# EAGLE design LED Pannel (EAGLE 9.6.2)
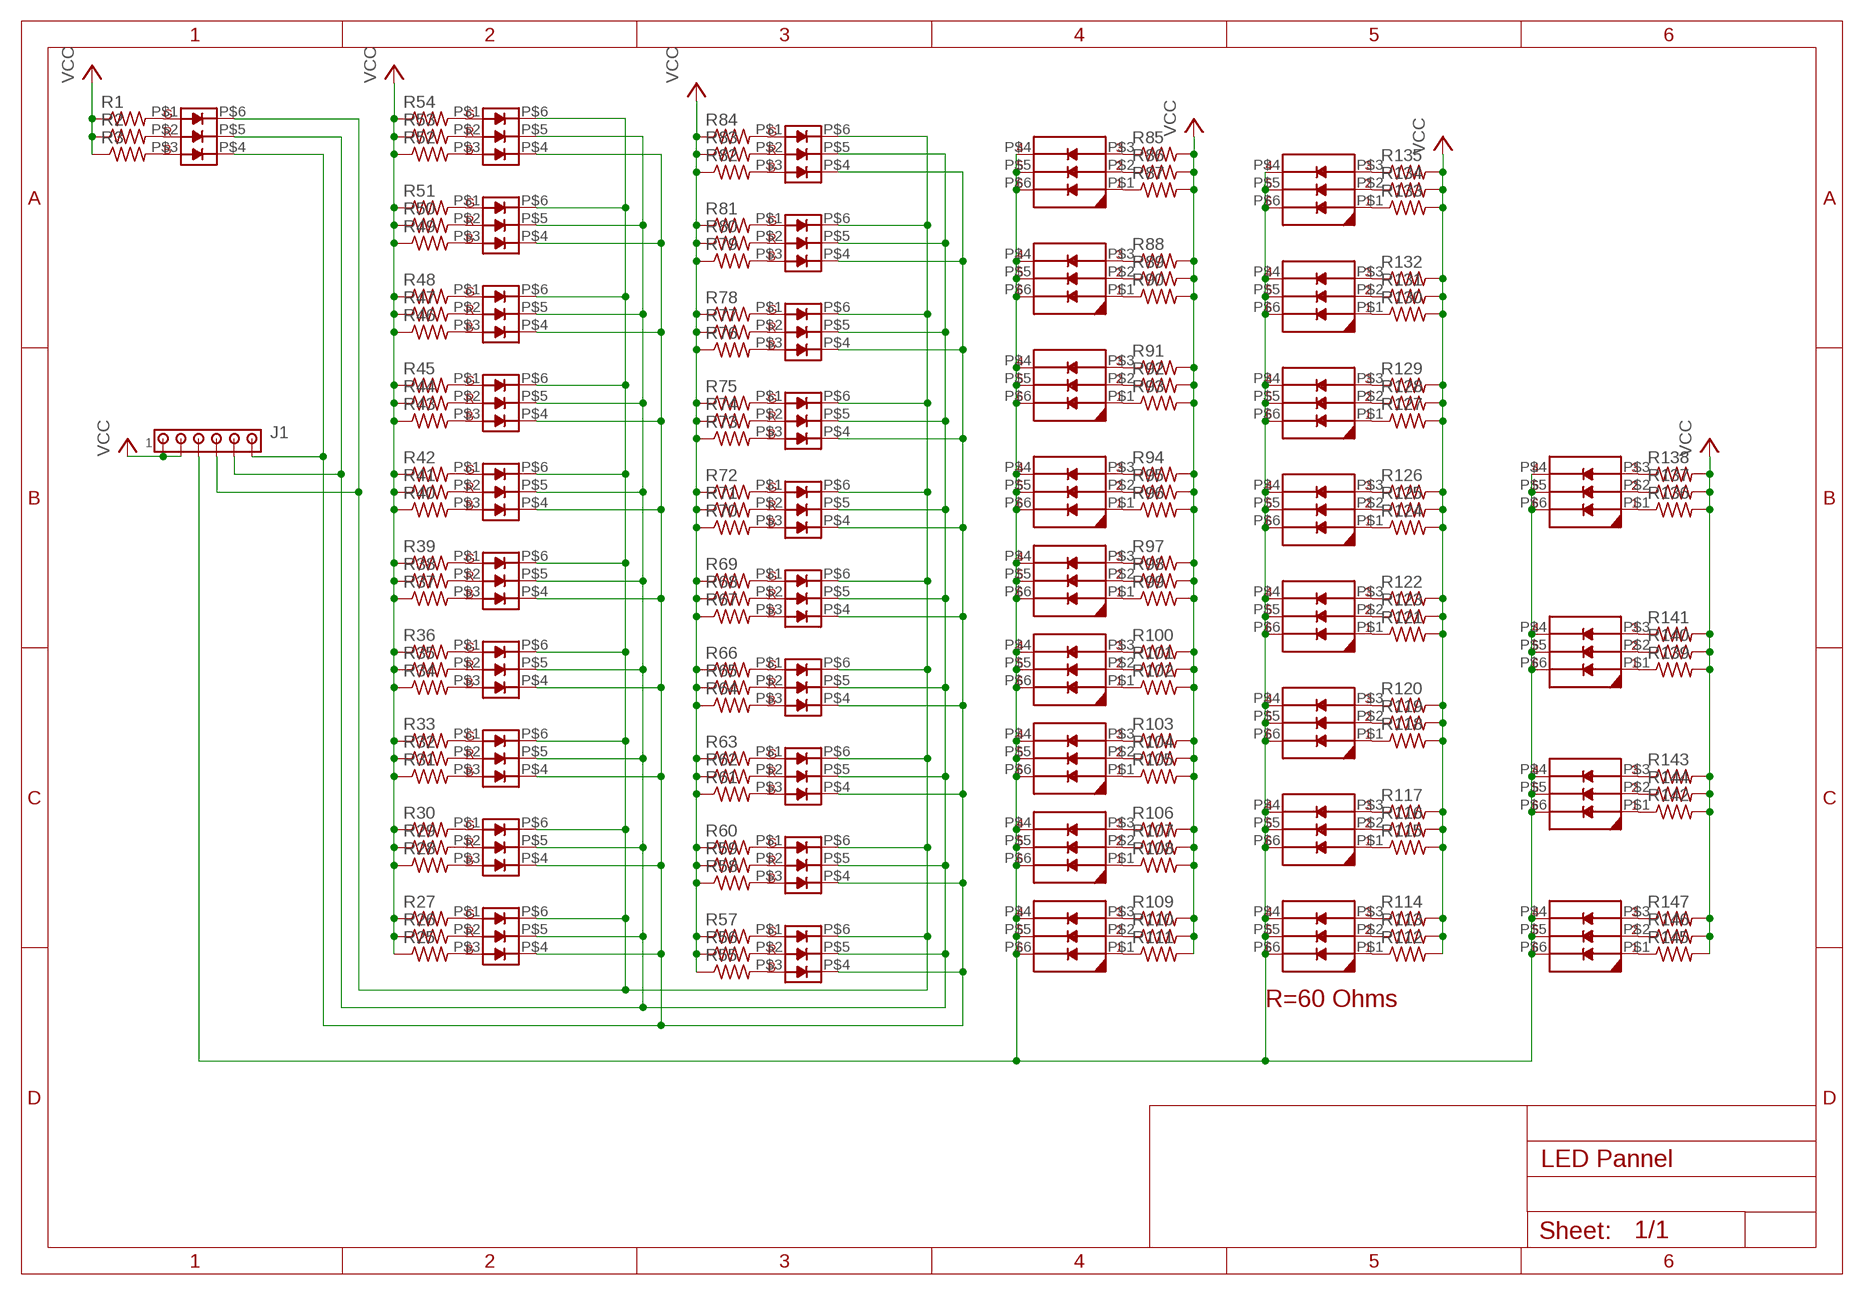
[diagram p0: schematic, sheet 1]

## Parts
J1  MTA06-156  [1X6MTA]
R1  R-US_R0603  [R0603]
R2  R-US_R0603  [R0603]
R3  R-US_R0603  [R0603]
R25  R-US_R0603  [R0603]
R26  R-US_R0603  [R0603]
R27  R-US_R0603  [R0603]
R28  R-US_R0603  [R0603]
R29  R-US_R0603  [R0603]
R30  R-US_R0603  [R0603]
R31  R-US_R0603  [R0603]
R32  R-US_R0603  [R0603]
R33  R-US_R0603  [R0603]
R34  R-US_R0603  [R0603]
R35  R-US_R0603  [R0603]
R36  R-US_R0603  [R0603]
R37  R-US_R0603  [R0603]
R38  R-US_R0603  [R0603]
R39  R-US_R0603  [R0603]
R40  R-US_R0603  [R0603]
R41  R-US_R0603  [R0603]
R42  R-US_R0603  [R0603]
R43  R-US_R0603  [R0603]
R44  R-US_R0603  [R0603]
R45  R-US_R0603  [R0603]
R46  R-US_R0603  [R0603]
R47  R-US_R0603  [R0603]
R48  R-US_R0603  [R0603]
R49  R-US_R0603  [R0603]
R50  R-US_R0603  [R0603]
R51  R-US_R0603  [R0603]
R52  R-US_R0603  [R0603]
R53  R-US_R0603  [R0603]
R54  R-US_R0603  [R0603]
R55  R-US_R0603  [R0603]
R56  R-US_R0603  [R0603]
R57  R-US_R0603  [R0603]
R58  R-US_R0603  [R0603]
R59  R-US_R0603  [R0603]
R60  R-US_R0603  [R0603]
R61  R-US_R0603  [R0603]
R62  R-US_R0603  [R0603]
R63  R-US_R0603  [R0603]
R64  R-US_R0603  [R0603]
R65  R-US_R0603  [R0603]
R66  R-US_R0603  [R0603]
R67  R-US_R0603  [R0603]
R68  R-US_R0603  [R0603]
R69  R-US_R0603  [R0603]
R70  R-US_R0603  [R0603]
R71  R-US_R0603  [R0603]
R72  R-US_R0603  [R0603]
R73  R-US_R0603  [R0603]
R74  R-US_R0603  [R0603]
R75  R-US_R0603  [R0603]
R76  R-US_R0603  [R0603]
R77  R-US_R0603  [R0603]
R78  R-US_R0603  [R0603]
R79  R-US_R0603  [R0603]
R80  R-US_R0603  [R0603]
R81  R-US_R0603  [R0603]
R82  R-US_R0603  [R0603]
R83  R-US_R0603  [R0603]
R84  R-US_R0603  [R0603]
R85  R-US_R0603  [R0603]
R86  R-US_R0603  [R0603]
R87  R-US_R0603  [R0603]
R88  R-US_R0603  [R0603]
R89  R-US_R0603  [R0603]
R90  R-US_R0603  [R0603]
R91  R-US_R0603  [R0603]
R92  R-US_R0603  [R0603]
R93  R-US_R0603  [R0603]
R94  R-US_R0603  [R0603]
R95  R-US_R0603  [R0603]
R96  R-US_R0603  [R0603]
R97  R-US_R0603  [R0603]
R98  R-US_R0603  [R0603]
R99  R-US_R0603  [R0603]
R100  R-US_R0603  [R0603]
R101  R-US_R0603  [R0603]
R102  R-US_R0603  [R0603]
R103  R-US_R0603  [R0603]
R104  R-US_R0603  [R0603]
R105  R-US_R0603  [R0603]
R106  R-US_R0603  [R0603]
R107  R-US_R0603  [R0603]
R108  R-US_R0603  [R0603]
R109  R-US_R0603  [R0603]
R110  R-US_R0603  [R0603]
R111  R-US_R0603  [R0603]
R112  R-US_R0603  [R0603]
R113  R-US_R0603  [R0603]
R114  R-US_R0603  [R0603]
R115  R-US_R0603  [R0603]
R116  R-US_R0603  [R0603]
R117  R-US_R0603  [R0603]
R118  R-US_R0603  [R0603]
R119  R-US_R0603  [R0603]
R120  R-US_R0603  [R0603]
R121  R-US_R0603  [R0603]
R122  R-US_R0603  [R0603]
R123  R-US_R0603  [R0603]
R124  R-US_R0603  [R0603]
R125  R-US_R0603  [R0603]
R126  R-US_R0603  [R0603]
R127  R-US_R0603  [R0603]
R128  R-US_R0603  [R0603]
R129  R-US_R0603  [R0603]
R130  R-US_R0603  [R0603]
R131  R-US_R0603  [R0603]
R132  R-US_R0603  [R0603]
R133  R-US_R0603  [R0603]
R134  R-US_R0603  [R0603]
R135  R-US_R0603  [R0603]
R136  R-US_R0603  [R0603]
R137  R-US_R0603  [R0603]
R138  R-US_R0603  [R0603]
R139  R-US_R0603  [R0603]
R140  R-US_R0603  [R0603]
R141  R-US_R0603  [R0603]
R142  R-US_R0603  [R0603]
R143  R-US_R0603  [R0603]
R144  R-US_R0603  [R0603]
R145  R-US_R0603  [R0603]
R146  R-US_R0603  [R0603]
R147  R-US_R0603  [R0603]
U$1  RGB_LED  [5050]
U$2  RGB_LED  [5050]
U$3  RGB_LED  [5050]
U$4  RGB_LED  [5050]
U$5  RGB_LED  [5050]
U$6  RGB_LED  [5050]
U$7  RGB_LED  [5050]
U$8  RGB_LED  [5050]
U$9  RGB_LED  [5050]
U$10  RGB_LED  [5050]
U$11  WHITE_LED  [5050]
U$12  WHITE_LED  [5050]
U$13  WHITE_LED  [5050]
U$14  WHITE_LED  [5050]
U$15  WHITE_LED  [5050]
U$16  WHITE_LED  [5050]
U$17  RGB_LED  [5050]
U$18  RGB_LED  [5050]
U$19  RGB_LED  [5050]
U$20  RGB_LED  [5050]
U$21  RGB_LED  [5050]
U$22  RGB_LED  [5050]
U$23  RGB_LED  [5050]
U$24  RGB_LED  [5050]
U$25  RGB_LED  [5050]
U$26  RGB_LED  [5050]
U$27  RGB_LED  [5050]
U$35  WHITE_LED  [5050]
U$36  WHITE_LED  [5050]
U$37  WHITE_LED  [5050]
U$38  WHITE_LED  [5050]
U$47  WHITE_LED  [5050]
U$48  WHITE_LED  [5050]
U$49  WHITE_LED  [5050]
U$50  WHITE_LED  [5050]
U$51  WHITE_LED  [5050]
U$52  WHITE_LED  [5050]
U$53  WHITE_LED  [5050]
U$54  WHITE_LED  [5050]
U$55  WHITE_LED  [5050]
U$56  WHITE_LED  [5050]
U$57  WHITE_LED  [5050]

## Nets
N$1: R1.2 U$27.P$1
N$2: R2.2 U$27.P$2
N$3: R3.2 U$27.P$3
N$4: J1.4 U$1.P$6 U$2.P$6 U$3.P$6 U$4.P$6 U$5.P$6 U$6.P$6 U$7.P$6 U$8.P$6 U$9.P$6 U$10.P$6 U$17.P$6 U$18.P$6 U$19.P$6 U$20.P$6 U$21.P$6 U$22.P$6 U$23.P$6 U$24.P$6 U$25.P$6 U$26.P$6 U$27.P$6
N$5: J1.5 U$1.P$5 U$2.P$5 U$3.P$5 U$4.P$5 U$5.P$5 U$6.P$5 U$7.P$5 U$8.P$5 U$9.P$5 U$10.P$5 U$17.P$5 U$18.P$5 U$19.P$5 U$20.P$5 U$21.P$5 U$22.P$5 U$23.P$5 U$24.P$5 U$25.P$5 U$26.P$5 U$27.P$5
N$6: J1.6 U$1.P$4 U$2.P$4 U$3.P$4 U$4.P$4 U$5.P$4 U$6.P$4 U$7.P$4 U$8.P$4 U$9.P$4 U$10.P$4 U$17.P$4 U$18.P$4 U$19.P$4 U$20.P$4 U$21.P$4 U$22.P$4 U$23.P$4 U$24.P$4 U$25.P$4 U$26.P$4 U$27.P$4
N$9: J1.3 U$11.P$4 U$11.P$5 U$11.P$6 U$12.P$4 U$12.P$5 U$12.P$6 U$13.P$4 U$13.P$5 U$13.P$6 U$14.P$4 U$14.P$5 U$14.P$6 U$15.P$4 U$15.P$5 U$15.P$6 U$16.P$4 U$16.P$5 U$16.P$6 U$35.P$4 U$35.P$5 U$35.P$6 U$36.P$4 U$36.P$5 U$36.P$6 U$37.P$4 U$37.P$5 U$37.P$6 U$38.P$4 U$38.P$5 U$38.P$6 U$47.P$4 U$47.P$5 U$47.P$6 U$48.P$4 U$48.P$5 U$48.P$6 U$49.P$4 U$49.P$5 U$49.P$6 U$50.P$4 U$50.P$5 U$50.P$6 U$51.P$4 U$51.P$5 U$51.P$6 U$52.P$4 U$52.P$5 U$52.P$6 U$53.P$4 U$53.P$5 U$53.P$6 U$54.P$4 U$54.P$5 U$54.P$6 U$55.P$4 U$55.P$5 U$55.P$6 U$56.P$4 U$56.P$5 U$56.P$6 U$57.P$4 U$57.P$5 U$57.P$6
N$24: R25.2 U$26.P$3
N$25: R26.2 U$26.P$2
N$26: R28.2 U$25.P$3
N$27: R29.2 U$25.P$2
N$28: R30.2 U$25.P$1
N$30: R27.2 U$26.P$1
N$31: R31.2 U$24.P$3
N$32: R32.2 U$24.P$2
N$33: R33.2 U$24.P$1
N$34: R34.2 U$23.P$3
N$35: R35.2 U$23.P$2
N$36: R36.2 U$23.P$1
N$37: R37.2 U$22.P$3
N$38: R38.2 U$22.P$2
N$39: R39.2 U$22.P$1
N$40: R40.2 U$21.P$3
N$41: R41.2 U$21.P$2
N$42: R42.2 U$21.P$1
N$43: R43.2 U$20.P$3
N$44: R44.2 U$20.P$2
N$45: R45.2 U$20.P$1
N$46: R46.2 U$19.P$3
N$47: R47.2 U$19.P$2
N$48: R48.2 U$19.P$1
N$49: R49.2 U$18.P$3
N$50: R50.2 U$18.P$2
N$51: R51.2 U$18.P$1
N$52: R52.2 U$17.P$3
N$53: R53.2 U$17.P$2
N$54: R54.2 U$17.P$1
N$55: R56.2 U$1.P$2
N$56: R57.2 U$1.P$1
N$57: R55.2 U$1.P$3
N$58: R58.2 U$2.P$3
N$59: R59.2 U$2.P$2
N$60: R60.2 U$2.P$1
N$61: R61.2 U$3.P$3
N$62: R62.2 U$3.P$2
N$63: R63.2 U$3.P$1
N$64: R64.2 U$4.P$3
N$65: R65.2 U$4.P$2
N$66: R66.2 U$4.P$1
N$67: R68.2 U$5.P$2
N$68: R69.2 U$5.P$1
N$69: R67.2 U$5.P$3
N$70: R70.2 U$6.P$3
N$71: R71.2 U$6.P$2
N$72: R72.2 U$6.P$1
N$73: R73.2 U$7.P$3
N$74: R74.2 U$7.P$2
N$75: R75.2 U$7.P$1
N$76: R76.2 U$8.P$3
N$77: R77.2 U$8.P$2
N$78: R78.2 U$8.P$1
N$79: R79.2 U$9.P$3
N$80: R80.2 U$9.P$2
N$81: R81.2 U$9.P$1
N$82: R82.2 U$10.P$3
N$83: R83.2 U$10.P$2
N$84: R84.2 U$10.P$1
N$85: R85.1 U$49.P$3
N$86: R86.1 U$49.P$2
N$87: R87.1 U$49.P$1
N$88: R88.1 U$48.P$3
N$89: R89.1 U$48.P$2
N$90: R90.1 U$48.P$1
N$91: R91.1 U$47.P$3
N$92: R92.1 U$47.P$2
N$93: R93.1 U$47.P$1
N$94: R95.1 U$16.P$2
N$95: R96.1 U$16.P$1
N$96: R94.1 U$16.P$3
N$97: R97.1 U$15.P$3
N$98: R98.1 U$15.P$2
N$99: R99.1 U$15.P$1
N$100: R100.1 U$14.P$3
N$101: R101.1 U$14.P$2
N$102: R102.1 U$14.P$1
N$103: R103.1 U$13.P$3
N$104: R104.1 U$13.P$2
N$105: R105.1 U$13.P$1
N$106: R106.1 U$12.P$3
N$107: R107.1 U$12.P$2
N$108: R108.1 U$12.P$1
N$109: R109.1 U$11.P$3
N$110: R110.1 U$11.P$2
N$111: R111.1 U$11.P$1
N$112: R112.1 U$57.P$1
N$113: R113.1 U$57.P$2
N$114: R114.1 U$57.P$3
N$115: R115.1 U$56.P$1
N$116: R116.1 U$56.P$2
N$117: R117.1 U$56.P$3
N$118: R118.1 U$55.P$1
N$119: R119.1 U$55.P$2
N$120: R120.1 U$55.P$3
N$121: R121.1 U$54.P$1
N$122: R122.1 U$54.P$3
N$123: R123.1 U$54.P$2
N$124: R124.1 U$53.P$1
N$125: R125.1 U$53.P$2
N$126: R126.1 U$53.P$3
N$127: R127.1 U$52.P$1
N$128: R128.1 U$52.P$2
N$129: R129.1 U$52.P$3
N$130: R130.1 U$51.P$1
N$131: R131.1 U$51.P$2
N$132: R132.1 U$51.P$3
N$133: R133.1 U$50.P$1
N$134: R134.1 U$50.P$2
N$135: R135.1 U$50.P$3
N$136: R136.1 U$38.P$1
N$137: R137.1 U$38.P$2
N$138: R138.1 U$38.P$3
N$139: R139.1 U$37.P$1
N$140: R140.1 U$37.P$2
N$141: R141.1 U$37.P$3
N$142: R142.1 U$36.P$1
N$143: R143.1 U$36.P$3
N$144: R144.1 U$36.P$2
N$145: R145.1 U$35.P$1
N$146: R146.1 U$35.P$2
N$147: R147.1 U$35.P$3
VCC: J1.1 J1.2 R1.1 R2.1 R3.1 R25.1 R26.1 R27.1 R28.1 R29.1 R30.1 R31.1 R32.1 R33.1 R34.1 R35.1 R36.1 R37.1 R38.1 R39.1 R40.1 R41.1 R42.1 R43.1 R44.1 R45.1 R46.1 R47.1 R48.1 R49.1 R50.1 R51.1 R52.1 R53.1 R54.1 R55.1 R56.1 R57.1 R58.1 R59.1 R60.1 R61.1 R62.1 R63.1 R64.1 R65.1 R66.1 R67.1 R68.1 R69.1 R70.1 R71.1 R72.1 R73.1 R74.1 R75.1 R76.1 R77.1 R78.1 R79.1 R80.1 R81.1 R82.1 R83.1 R84.1 R85.2 R86.2 R87.2 R88.2 R89.2 R90.2 R91.2 R92.2 R93.2 R94.2 R95.2 R96.2 R97.2 R98.2 R99.2 R100.2 R101.2 R102.2 R103.2 R104.2 R105.2 R106.2 R107.2 R108.2 R109.2 R110.2 R111.2 R112.2 R113.2 R114.2 R115.2 R116.2 R117.2 R118.2 R119.2 R120.2 R121.2 R122.2 R123.2 R124.2 R125.2 R126.2 R127.2 R128.2 R129.2 R130.2 R131.2 R132.2 R133.2 R134.2 R135.2 R136.2 R137.2 R138.2 R139.2 R140.2 R141.2 R142.2 R143.2 R144.2 R145.2 R146.2 R147.2

## Notes on the sheet
- R=60 Ohms

## Library data of the parts
J1 = con-amp:MTA06-156: AMP connector
R1-R3 R25-R147 = rcl:R-US_: RESISTOR, American symbol; SPICEPREFIX: R
U$1-U$10 U$17-U$27 = RGB LED:RGB_LED
U$11-U$16 U$35-U$38 U$47-U$57 = white led:WHITE_LED

## Board
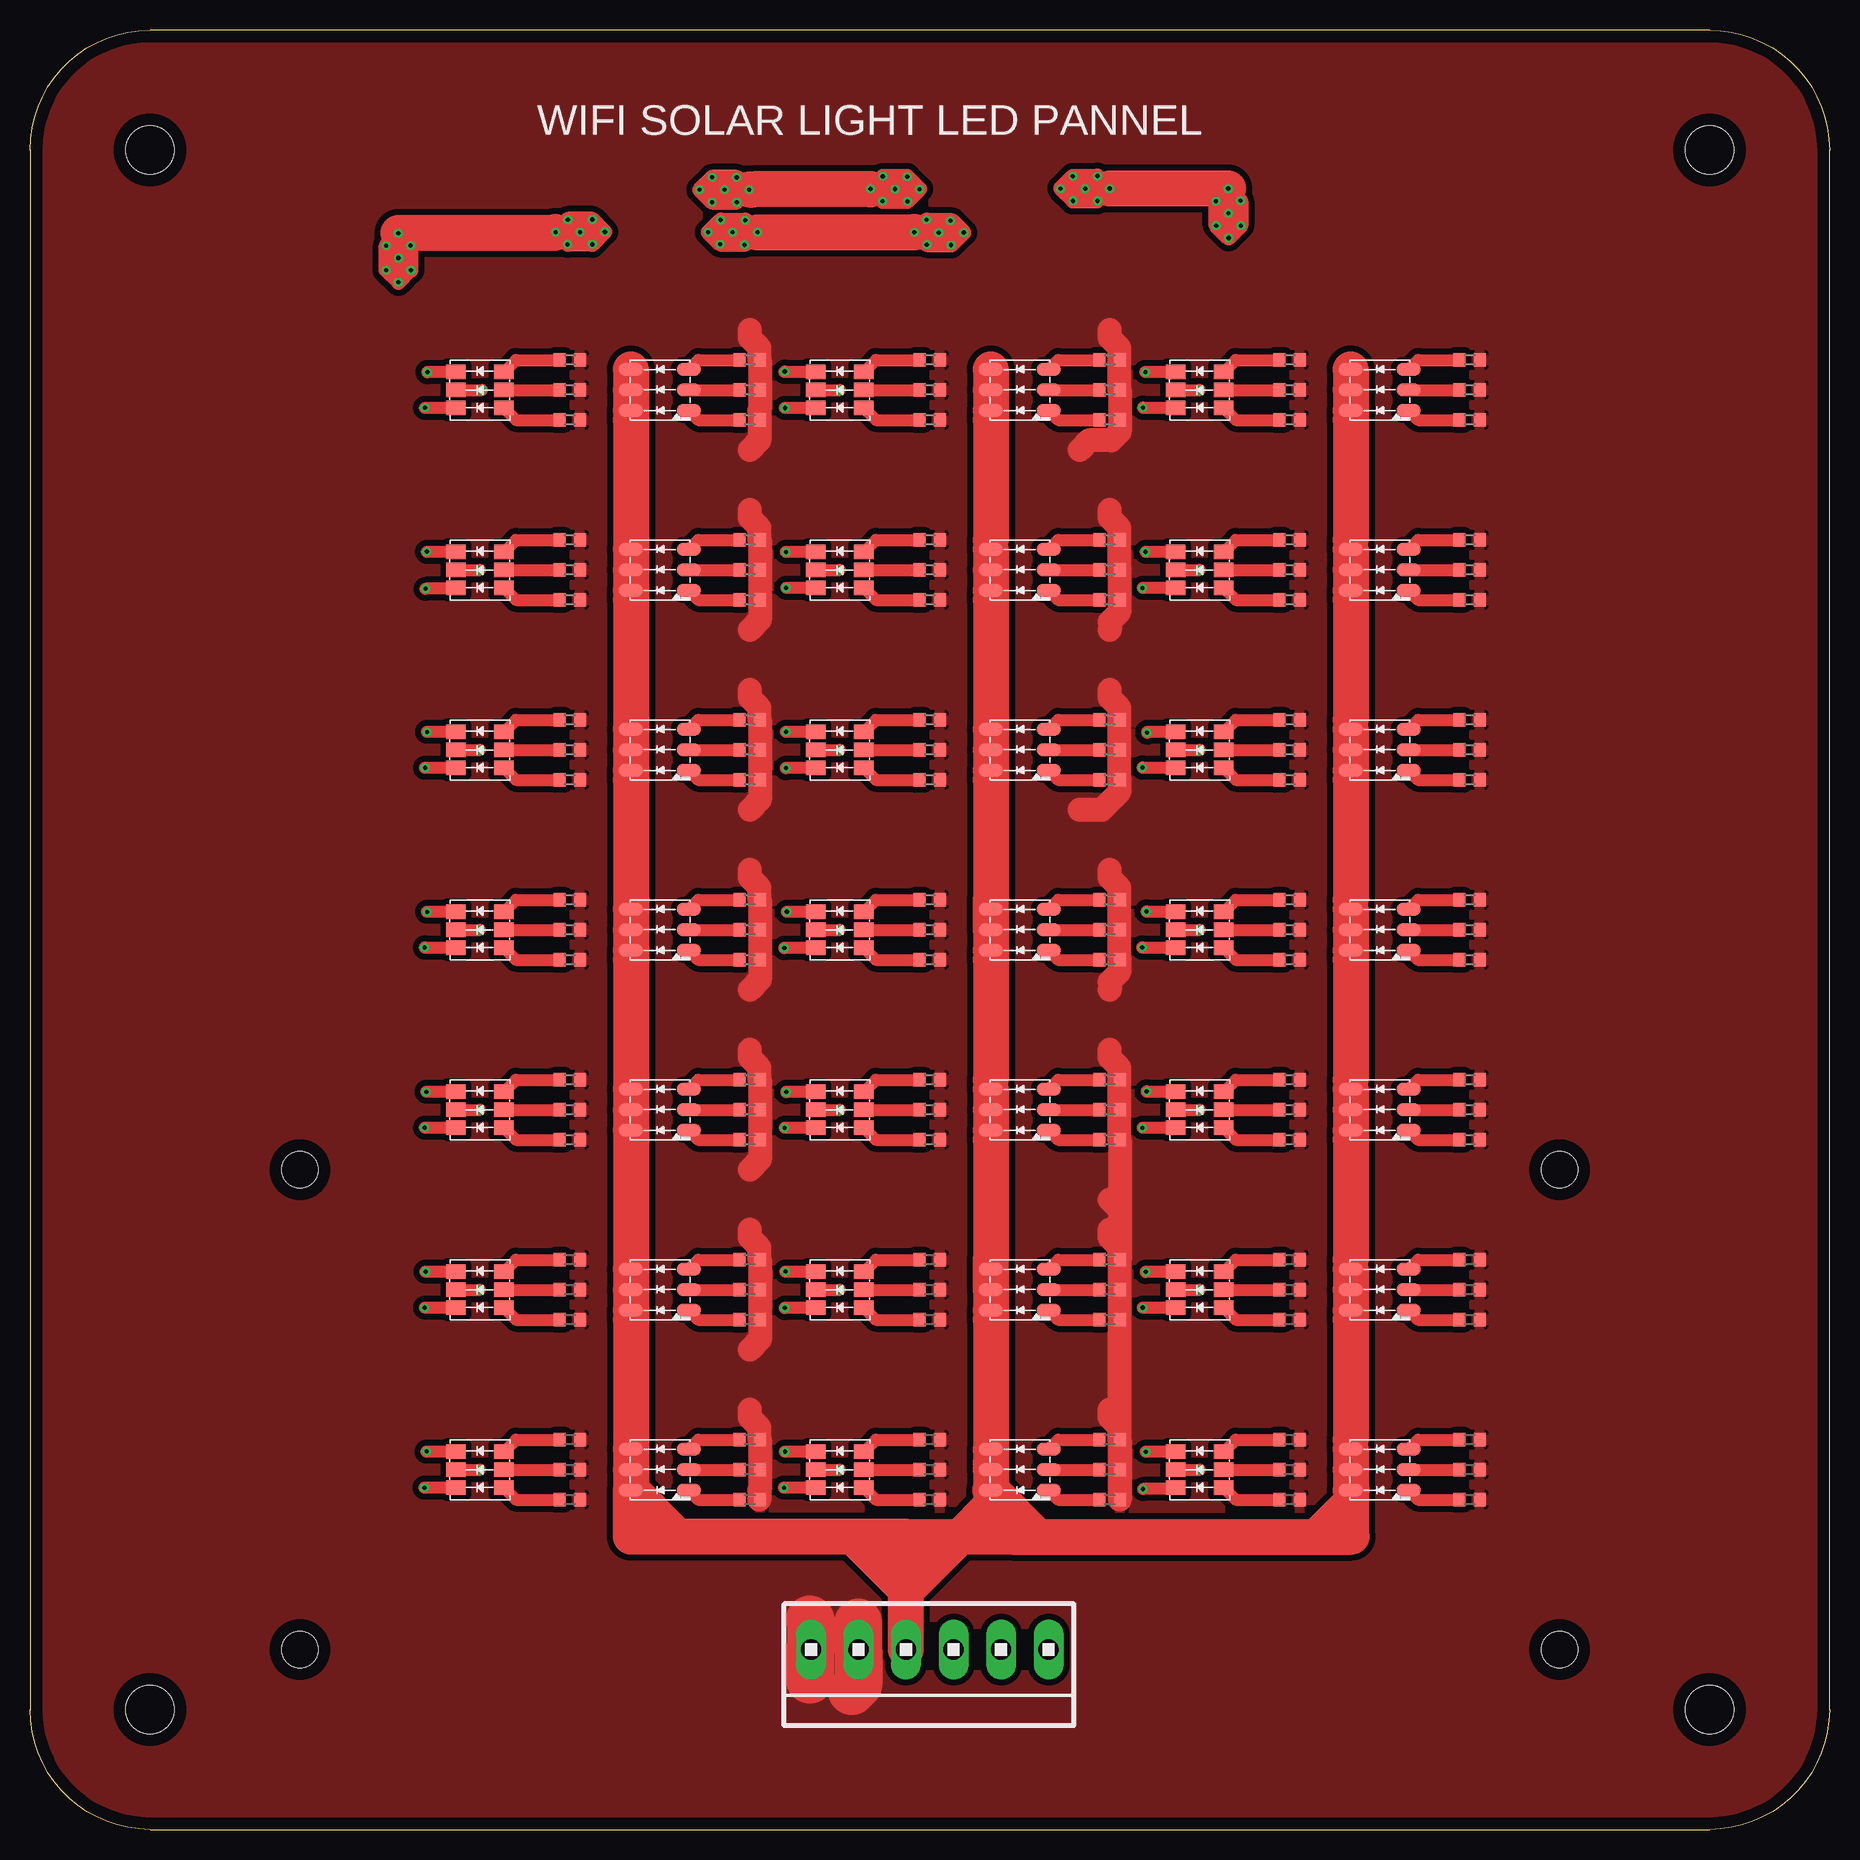
[diagram p1: board, top side]
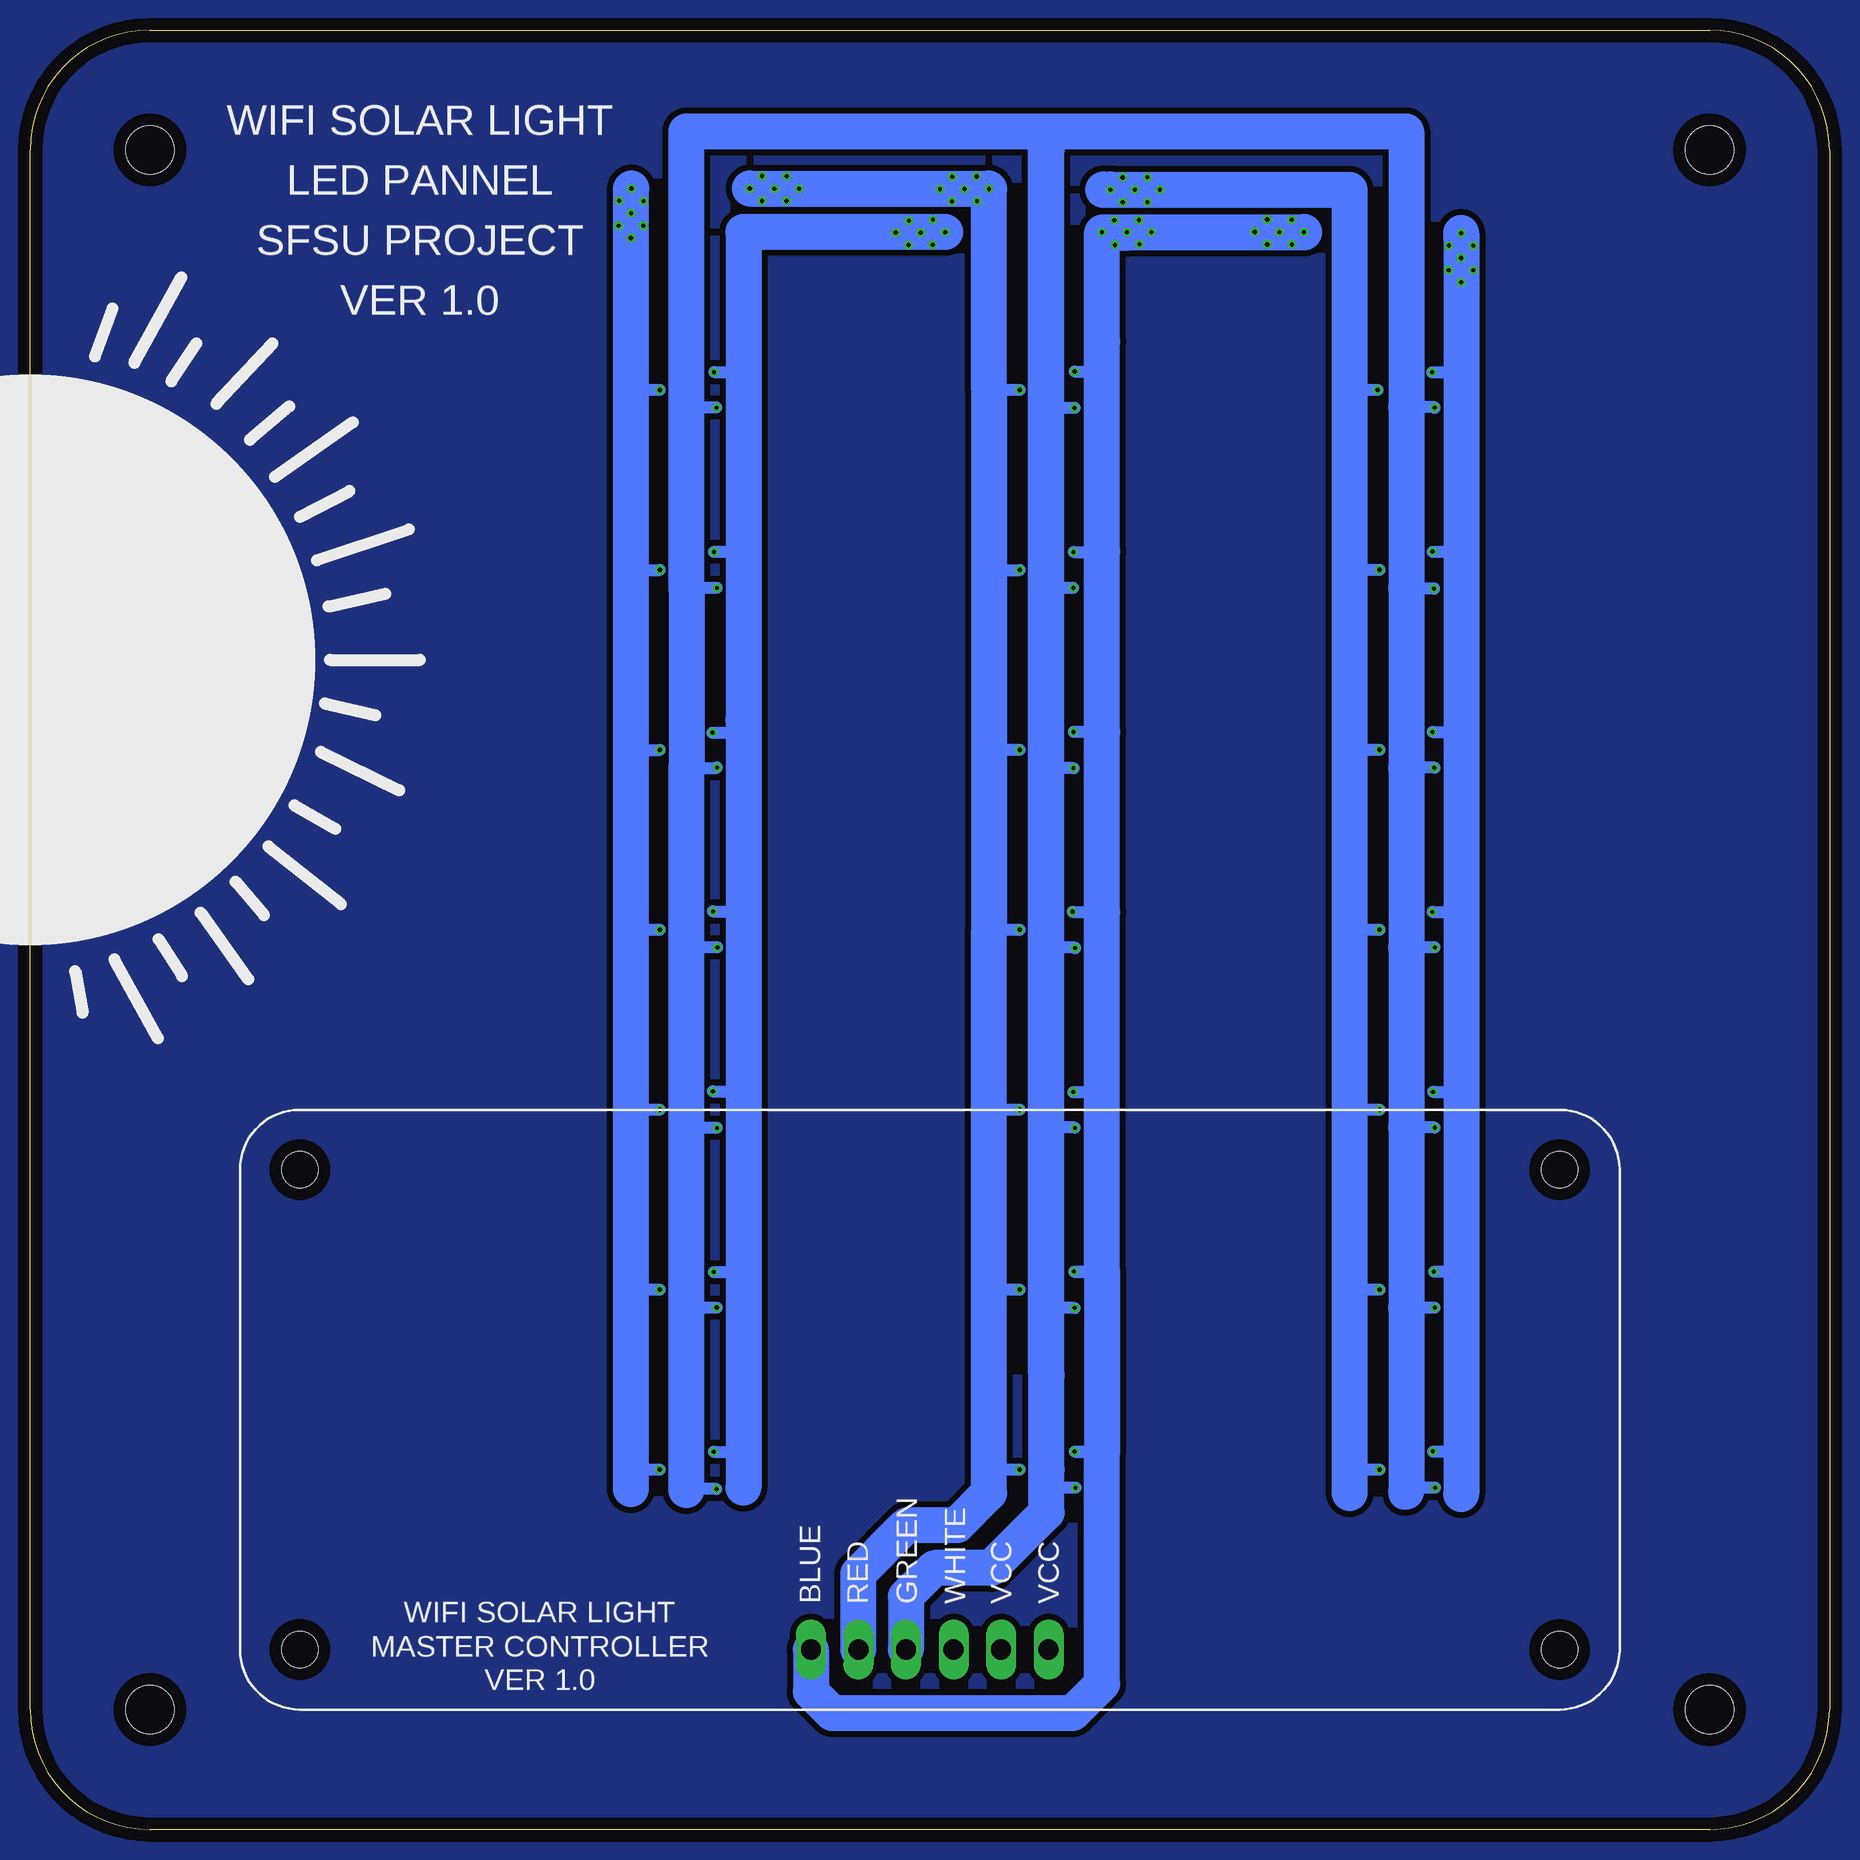
[diagram p2: board, bottom side, seen from below]

Size 150 x 150 mm. Coordinates in mm from the lower left corner, seen from the top.
Outline: 10,0 140,0 arc90 150,10 150,140 arc90 140,150 10,150 arc90 0,140 0,10 arc90 10,0
Copper layers (1*16): Top 0.035mm / dielectric 1.5mm / Bottom 0.035mm
Design rules "default *": minimum track width 6mil, minimum drill 0.35mm, track to track 6mil, track to pad 6mil, pad to pad 6mil, via to via 6mil, smd to smd 6mil, copper to edge 40mil, drill to drill 6mil, minimum pad ring 10mil, minimum via ring 8mil, stop-mask expansion 4mil, vias tented up to drill 100mil, thermal gap 10mil
Holes 4 mm at 10,140 10,10 140,10 140,140
Holes 3 mm at 22.5,15 127.5,15 22.5,55 127.5,55

### Footprints (pad centres in the part's own frame; a part is rotated, then mirrored left to right if it is on the bottom)
1X6MTA = drill 1.676 long: 1 9.906,0; 2 5.944,0; 3 1.981,0; 4 -1.981,0; 5 -5.944,0; 6 -9.906,0
R0603 = smd 1 x 1.1: 1 -0.85,0; 2 0.85,0
5050 = smd 1.6 x 1.2: P$1 -2,1.5; P$2 -2,0; P$3 -2,-1.5; P$4 2,-1.5; P$5 2,0; P$6 2,1.5
5050' = smd 2 x 1.1: P$1 2.4,-1.7; P$2 2.4,0; P$3 2.4,1.7; P$4 -2.4,1.7; P$5 -2.4,0; P$6 -2.4,-1.7

### Placement (x,y rotation side)
J1  75,15 180 top
R1  45,27.5 180 top
R2  45,30 180 top
R3  45,32.5 180 top
R25  45,47.5 180 top
R26  45,45 180 top
R27  45,42.5 180 top
R28  45,62.5 180 top
R29  45,60 180 top
R30  45,57.5 180 top
R31  45,77.5 180 top
R32  45,75 180 top
R33  45,72.5 180 top
R34  45,92.5 180 top
R35  45,90 180 top
R36  45,87.5 180 top
R37  45,107.5 180 top
R38  45,105 180 top
R39  45,102.5 180 top
R40  45,122.5 180 top
R41  45,120 180 top
R42  45,117.5 180 top
R43  105,32.5 180 top
R44  105,30 180 top
R45  105,27.5 180 top
R46  105,47.5 180 top
R47  105,45 180 top
R48  105,42.5 180 top
R49  105,62.5 180 top
R50  105,60 180 top
R51  105,57.5 180 top
R52  105,77.5 180 top
R53  105,75 180 top
R54  105,72.5 180 top
R55  75,77.5 180 top
R56  75,75 180 top
R57  75,72.5 180 top
R58  75,122.5 180 top
R59  75,120 180 top
R60  75,117.5 180 top
R61  105,122.5 180 top
R62  105,120 180 top
R63  105,117.5 180 top
R64  105,92.5 180 top
R65  105,90 180 top
R66  105,87.5 180 top
R67  75,92.5 180 top
R68  75,90 180 top
R69  75,87.5 180 top
R70  75,107.5 180 top
R71  75,105 180 top
R72  75,102.5 180 top
R73  105,107.5 180 top
R74  105,105 180 top
R75  105,102.5 180 top
R76  75,32.5 180 top
R77  75,30 180 top
R78  75,27.5 180 top
R79  75,62.5 180 top
R80  75,60 180 top
R81  75,57.5 180 top
R82  75,47.5 180 top
R83  75,45 180 top
R84  75,42.5 180 top
R85  120,47.5 0 top
R86  120,45 0 top
R87  120,42.5 0 top
R88  120,32.5 0 top
R89  120,30 0 top
R90  120,27.5 0 top
R91  90,122.5 0 top
R92  90,120 0 top
R93  90,117.5 0 top
R94  90,107.5 0 top
R95  90,105 0 top
R96  90,102.5 0 top
R97  90,77.5 0 top
R98  90,75 0 top
R99  90,72.5 0 top
R100  90,62.5 0 top
R101  90,60 0 top
R102  90,57.5 0 top
R103  90,92.5 0 top
R104  90,90 0 top
R105  90,87.5 0 top
R106  90,32.5 0 top
R107  90,30 0 top
R108  90,27.5 0 top
R109  90,47.5 0 top
R110  90,45 0 top
R111  90,42.5 0 top
R112  60,57.5 0 top
R113  60,60 0 top
R114  60,62.5 0 top
R115  60,42.5 0 top
R116  60,45 0 top
R117  60,47.5 0 top
R118  60,27.5 0 top
R119  60,30 0 top
R120  60,32.5 0 top
R121  120,117.5 0 top
R122  120,122.5 0 top
R123  120,120 0 top
R124  120,102.5 0 top
R125  120,105 0 top
R126  120,107.5 0 top
R127  120,87.5 0 top
R128  120,90 0 top
R129  120,92.5 0 top
R130  120,72.5 0 top
R131  120,75 0 top
R132  120,77.5 0 top
R133  120,57.5 0 top
R134  120,60 0 top
R135  120,62.5 0 top
R136  60,117.5 0 top
R137  60,120 0 top
R138  60,122.5 0 top
R139  60,102.5 0 top
R140  60,105 0 top
R141  60,107.5 0 top
R142  60,87.5 0 top
R143  60,92.5 0 top
R144  60,90 0 top
R145  60,72.5 0 top
R146  60,75 0 top
R147  60,77.5 0 top
U$1  67.5,75 180 top
U$2  67.5,120 180 top
U$3  97.5,120 180 top
U$4  97.5,90 180 top
U$5  67.5,90 180 top
U$6  67.5,105 180 top
U$7  97.5,105 180 top
U$8  67.5,30 180 top
U$9  67.5,60 180 top
U$10  67.5,45 180 top
U$11  WHITE_LED  [5050']  82.5,45 0 top
U$12  WHITE_LED  [5050']  82.5,30 0 top
U$13  WHITE_LED  [5050']  82.5,90 0 top
U$14  WHITE_LED  [5050']  82.5,60 0 top
U$15  WHITE_LED  [5050']  82.5,75 0 top
U$16  WHITE_LED  [5050']  82.5,105 0 top
U$17  97.5,75 180 top
U$18  97.5,60 180 top
U$19  97.5,45 180 top
U$20  97.5,30 180 top
U$21  37.5,120 180 top
U$22  37.5,105 180 top
U$23  37.5,90 180 top
U$24  37.5,75 180 top
U$25  37.5,60 180 top
U$26  37.5,45 180 top
U$27  37.5,30 180 top
U$35  WHITE_LED  [5050']  52.5,75 0 top
U$36  WHITE_LED  [5050']  52.5,90 0 top
U$37  WHITE_LED  [5050']  52.5,105 0 top
U$38  WHITE_LED  [5050']  52.5,120 0 top
U$47  WHITE_LED  [5050']  82.5,120 0 top
U$48  WHITE_LED  [5050']  112.5,30 0 top
U$49  WHITE_LED  [5050']  112.5,45 0 top
U$50  WHITE_LED  [5050']  112.5,60 0 top
U$51  WHITE_LED  [5050']  112.5,75 0 top
U$52  WHITE_LED  [5050']  112.5,90 0 top
U$53  WHITE_LED  [5050']  112.5,105 0 top
U$54  WHITE_LED  [5050']  112.5,120 0 top
U$55  WHITE_LED  [5050']  52.5,30 0 top
U$56  WHITE_LED  [5050']  52.5,45 0 top
U$57  WHITE_LED  [5050']  52.5,60 0 top

### Tracks (layer width: path | path; a pad name or v marks a point on that pad's centre or on a via)
N$1
  Top 1.016: U$27.P$1 40.5,27.5 R1.2
N$2
  Top 1.016: U$27.P$2 R2.2
N$3
  Top 1.016: U$27.P$3 40.5,32.5 R3.2
N$4  (via drill 0.35)
  Top 1.016: U$23.P$6 v32.94,88.5 | U$22.P$6 35.5,103.43 v32.98,103.43 | U$21.P$6 32.92,118.5 v32.92,118.52 | U$24.P$6 32.9,73.5 v32.9,73.53 | U$25.P$6 v32.9,58.5 v32.9,58.51 | U$26.P$6 v32.9,43.5 | U$27.P$6 32.87,28.5 v32.87,28.48 | U$8.P$6 62.85,28.5 v62.85,28.48 | U$10.P$6 62.92,43.5 v62.92,43.47 | U$9.P$6 62.9,58.5 v62.9,58.48 | U$1.P$6 62.88,73.5 v62.88,73.47 | U$5.P$6 63.01,88.5 v63.01,88.47 | U$6.P$6 v63.03,103.5 | U$2.P$6 v62.93,118.5 | U$20.P$6 95.5,28.38 v92.77,28.38 | U$19.P$6 v92.75,43.5 v92.75,43.49 | U$18.P$6 v92.73,58.5 v92.73,58.49 | U$17.P$6 92.72,73.5 v92.72,73.53 | v92.73,88.53 92.73,88.5 U$4.P$6 | U$7.P$6 v92.73,103.5 v92.73,103.49 | U$3.P$6 92.77,118.5 v92.77,118.52
  Bottom 1.016: v32.94,88.5 35.29,88.5 | v32.98,103.43 32.98,103.45 35.29,103.45 | v32.92,118.52 32.92,118.56 35.29,118.56 | v32.9,73.53 35.29,73.53 | v32.9,58.51 35.29,58.51 | v32.9,43.5 35.29,43.5 35.29,43.52 | v32.87,28.48 35.29,28.48 35.29,28.16 | v62.85,28.48 62.85,28.5 64.74,28.5 64.74,28.51 65.26,28.51 65.26,28.37 65.83,28.37 65.83,44.99 65.55,44.99 65.26,44.99 65.26,30 | v62.92,43.47 65.26,43.47 | v62.9,58.48 62.9,58.51 65.55,58.51 | v62.88,73.47 62.88,73.51 65.26,73.51 | v63.01,88.47 65.26,88.47 | v63.03,103.5 65.26,103.5 65.26,103.43 65.55,103.43 | v62.93,118.5 65.26,118.5 65.26,118.43 | v92.77,28.38 95.29,28.38 95.29,28.29 | v92.75,43.49 95.29,43.49 | v92.73,58.49 95.29,58.49 | v92.72,73.53 95.29,73.53 | v92.73,88.53 92.77,88.49 95.29,88.49 95.29,88.58 | v92.73,103.49 95.29,103.49 95.29,103.45 | v92.77,118.52 95.29,118.52 | 65.55,103.43 65.55,105 | 65.55,90 65.55,103.43
  Bottom 2.54: 65.55,140.69 65.55,105 65.55,90 65.55,58.51 65.55,44.99 65.55,38.18 65.26,37.88 | 65.26,37.88 | 35.29,28.16 35.5,27.95
  Bottom 3: J1.4 76.98,19.43 74.6,21.81 69.88,21.81 65.26,26.43 65.26,28.37 65.26,30 65.26,37.88 65.26,43.47 65.26,73.51 65.26,88.47 65.26,103.43 65.26,118.43 65.26,140.04 | 66.14,141.55 65.42,140.82 65.55,140.69 | 66.14,141.55 35.29,141.55 35.29,118.56 35.29,103.45 35.29,88.5 35.29,73.53 35.29,58.51 35.29,43.52 35.29,28.16 | 95.29,28.29 95.29,43.49 95.29,58.49 95.29,73.53 95.29,88.49 | 95.29,88.58 95.29,103.45 95.29,118.52 95.29,141.55 66.14,141.55
N$5  (via drill 0.35)
  Top 1.016: U$26.P$5 v37.5,45 | U$27.P$5 v37.5,30 | U$25.P$5 v37.5,60 | U$24.P$5 v37.5,75 | U$23.P$5 v37.5,90 | U$22.P$5 v37.5,105 | U$21.P$5 v37.66,120 | U$2.P$5 v67.5,120 | U$6.P$5 v67.5,105 | U$5.P$5 v67.5,90 | U$9.P$5 v67.5,60 | U$10.P$5 v67.5,45 | U$8.P$5 v67.5,30 | U$20.P$5 v97.5,30 | U$19.P$5 v97.5,45 | U$18.P$5 v97.5,60 | U$17.P$5 v97.5,75 | U$4.P$5 v97.5,90 | U$7.P$5 v97.5,105 | U$3.P$5 v97.5,120 | U$1.P$5 v67.5,75
  Top 1.27: v55.82,136.68 56.85,137.71 v56.85,137.72 v56.85,137.71 v58.91,137.71 v59.93,136.69 v59.94,136.69 v57.9,136.69 55.83,136.69 v55.82,136.68 | v55.82,136.68 56.85,135.66 v56.86,135.66 56.87,135.65 v58.92,135.65 | v74.15,136.73 v73.14,135.71 73.12,135.72 v71.07,135.72 71.07,135.75 v70.06,136.76 72.09,136.76 v72.11,136.74 | v74.15,136.73 v73.12,137.76 v73.12,137.77 71.11,137.77 v71.09,137.8 | v72.11,136.74 72.11,137.1 72.5,137.5 73.38,137.5 v74.15,136.73 | v74.15,136.73 72.12,136.73 v72.11,136.74 | v90,136.79 89.98,136.77 v87.95,136.77 | v87.95,136.77 v88.98,135.75 | v88.98,135.75 | v88.98,135.75 86.94,135.75 v86.93,135.76 v86.92,135.76 v85.9,136.78 | v85.9,136.78 v86.92,137.8 v86.92,137.81 88.95,137.81 v88.97,137.83 | v87.95,136.77 v87.94,136.78 v85.9,136.78 | v99.91,132.67 99.91,134.7 v99.89,134.72 99.89,136.78 v99.88,136.79 v100.9,135.76 100.93,135.74 v100.93,133.7 100.93,133.68 v99.91,132.67 | v99.91,132.67 99.9,132.67 v98.87,133.69 98.86,133.71 v98.86,135.74
  Top 3: v59.94,136.69 60.27,136.69 60.3,136.72 70.03,136.72 v70.06,136.76 | v99.88,136.79 v90,136.79
  Bottom 1.016: v37.5,45 40,45 | v37.5,30 40,30 | v37.5,60 40,60 | v37.5,75 40,75 | v37.5,90 40,90 | v37.5,105 40,105 | v37.66,120 40,120 | v67.5,120 70.05,120 | v97.5,30 99.92,30 | 99.92,30 99.92,28.4 | v97.5,45 99.92,45 | 99.92,45 100,45 | v97.5,60 99.92,60 | v97.5,75 99.92,75 | 99.92,90 v97.5,90 | 99.92,105 v97.5,105 | v97.5,120 99.92,120 | 99.92,120 100,120 | 99.92,120 99.92,105 | 100,105 99.92,105 | 99.92,105 99.92,90 | 99.92,90 100,90 | 99.92,30 99.92,45 | v67.5,75 70.05,75 70.05,60 | v67.5,60 70.05,60 | 70.05,60 70.05,45 70,45 | v67.5,90 70,90 | 70.05,90 70,90 | 70,90 70,105 v67.5,105 70.05,105 | v67.5,30 70,30 70,45 | v67.5,45 70,45
  Bottom 3: J1.5 80.94,21.33 76.88,25.39 72.7,25.39 70.05,28.04 70.05,45 70.05,75 70.05,90 70.05,105 70.05,120 70.05,136.74 v70.06,136.76 70.09,136.79 v90,136.79 | 99.92,28.4 99.92,45 99.92,60 99.92,75 99.92,90 99.92,120 99.92,136.75 v99.88,136.79 | 40.02,28.04 40,28.06 40,30 40,45 40,60 40,75 40,90 40,105 40,120 40,136.68 60.55,136.68 60.54,136.69 v59.94,136.69 | v90,136.79
N$6  (via drill 0.35)
  Top 1.016: U$27.P$4 33.06,31.5 v33.06,31.52 | U$26.P$4 v32.97,46.5 | U$25.P$4 33.04,61.5 v33.04,61.48 | U$24.P$4 33.1,76.5 v33.1,76.48 | U$23.P$4 v33.1,91.5 v33.1,91.49 | U$22.P$4 v33.08,106.5 v33.08,106.51 | U$21.P$4 33.12,121.5 v33.12,121.47 | U$8.P$4 v62.93,31.5 | U$10.P$4 62.98,46.5 v62.98,46.52 | U$9.P$4 63.04,61.5 v63.04,61.48 | U$1.P$4 v63.09,76.5 | U$5.P$4 v63.02,91.5 v63.01,91.51 | U$6.P$4 63.02,106.5 v63.02,106.48 | U$2.P$4 62.88,121.5 v62.92,121.53 | U$20.P$4 v93.01,31.5 v93.01,31.49 | U$19.P$4 93.01,46.5 v93.01,46.47 | U$18.P$4 93.09,61.5 v93.09,61.52 | U$17.P$4 93.07,76.5 v93.07,76.53 | U$4.P$4 93.11,91.5 v93.11,91.43 | U$7.P$4 v92.98,106.5 | U$3.P$4 v92.97,121.5 v92.97,121.49
  Top 1.27: v47.91,133.17 47.9,133.16 v45.85,133.16 v43.81,133.16 44.81,132.15 v44.81,132.13 v46.88,132.13 v47.91,133.17 | v47.91,133.17 v46.88,134.21 44.85,134.21 v44.83,134.19 | v59.63,134.15 v60.64,133.14 59.65,132.15 v57.53,132.15 v56.52,133.16 | v59.63,134.15 v59.62,134.15 58.61,133.14 v58.56,133.14 56.54,133.14 v56.52,133.16 | v56.52,133.16 56.56,133.16 v57.57,134.17 59.61,134.17 v59.63,134.15 | v73.71,133.15 75.7,133.15 v75.75,133.1 77.8,133.1 | v73.71,133.15 v74.74,134.18 74.83,134.09 v76.74,134.09 76.86,134.09 v77.84,133.12 77.82,133.1 77.8,133.1 | v73.71,133.15 v73.72,133.15 v74.76,132.11 76.74,132.11 v76.77,132.08 77.8,133.1 | v30.71,128.98 v30.71,131 30.71,133.06 v30.7,133.07 30.7,133.04 v29.69,132.03 29.69,130 v29.68,129.99 29.7,129.99 v30.71,128.98 | v30.71,128.98 31.71,129.97 v31.75,129.97 31.75,132.02 v31.74,132.03
  Top 3: v60.64,133.14 v73.7,133.14 v73.71,133.15 | v43.81,133.16 43.72,133.07 v30.7,133.07
  Bottom 1.016: v33.06,31.52 30.69,31.52 30.69,31.34 | v32.97,46.5 31.65,46.5 31.65,46.39 30.69,46.39 30.69,46.41 | 30.69,61.44 30.69,61.42 31.5,61.42 31.5,61.48 v33.04,61.48 | v33.1,76.48 30.69,76.48 30.69,76.42 | v33.1,91.49 30.69,91.49 30.69,91.44 | 30.69,106.53 30.69,106.51 v33.08,106.51 | v33.12,121.47 31.45,121.47 31.45,121.49 30.69,121.49 | 61.46,31.51 61.46,31.5 v62.93,31.5 60.64,31.5 | v62.98,46.52 61.22,46.52 | 61.22,46.52 61.22,46.49 | 61.54,61.36 61.54,61.48 | v63.09,76.5 61.44,76.5 61.44,76.4 60.64,76.4 60.64,76.45 | v63.01,91.51 61.35,91.51 61.35,91.44 60.64,91.44 60.64,91.49 | v63.02,106.48 61.46,106.48 61.46,106.53 60.64,106.53 | v93.01,31.49 90.52,31.49 90.52,31.51 | v93.01,46.47 91.04,46.47 91.04,46.64 90.52,46.64 | v93.09,61.52 90.52,61.52 90.52,61.4 | v93.07,76.53 90.52,76.53 | v93.11,91.43 91.14,91.43 91.14,92.5 90.52,92.5 | v92.98,106.5 90.52,106.5 90.52,106.48 | v92.97,121.49 90.52,121.49 | v63.04,61.48 61.54,61.48 | 61.54,61.48 61.22,61.48 61.22,46.52 | 60.64,124.06 60.64,121.53 v62.92,121.53 | 60.64,46.49 61.22,46.49 | v62.98,46.52 62.98,46.49 61.22,46.49 | v62.98,46.52 60.64,46.52 | v59.57,132.09 58.55,132.09 57.5,133.14
  Bottom 3: J1.6 84.91,11.49 83.14,9.72 63.07,9.72 60.64,12.15 60.64,31.5 60.64,46.49 60.64,46.52 60.64,76.45 60.64,91.49 60.64,106.53 60.64,124.06 v60.64,133.13 v60.64,133.14 57.5,133.14 43.81,133.14 v43.81,133.16 | v73.71,133.15 90.52,133.15 90.52,121.49 90.52,106.48 90.52,92.5 90.52,76.53 90.52,61.4 90.52,46.64 90.52,31.51 90.52,28.48 | v30.7,133.07 30.7,132.72 30.69,132.71 30.69,121.49 30.69,106.53 30.69,91.44 30.69,76.42 30.69,61.44 30.69,46.41 30.69,31.34 30.69,27.97
N$9
  Top 1.016: 80.1,31.87 80.1,31.66 U$12.P$4 | U$12.P$6 U$12.P$5
  Top 1.27: 50.1,42.5 U$56.P$6 U$56.P$5
  Top 2.54: U$55.P$4 50.1,42.5 | U$57.P$4 50.1,72.5 | U$35.P$4 50.1,87.5 | U$36.P$4 50.1,102.5 | U$37.P$4 50.1,117.5 | 80.1,87.5 80.1,77.5 | U$15.P$5 80.1,72.5 80.1,62.5 U$14.P$5 | 80.1,57.5 80.1,47.5 | 80.1,42.5 U$11.P$5 | U$13.P$4 80.1,102.5 | U$16.P$5 80.1,107.5 80.1,117.5 | 110.1,117.5 110.1,107.5 U$53.P$5 | 110.1,102.5 110.1,92.5 U$52.P$5 | 110.1,87.5 110.1,77.5 U$51.P$5 | 110.1,72.5 110.1,62.5 U$50.P$5 | 110.1,57.5 110.1,47.5 U$49.P$5 | 110.1,42.5 110.1,32.5 U$48.P$5
  Top 3: J1.3 73.02,20 | 73.02,24.4 73.02,20 | U$55.P$6 50.1,24.4 54,24.4 | 73.02,24.4 68.89,24.4 | 68.89,24.4 54,24.4 | 73.02,24.4 77.5,24.4 | 81.9,24.4 110.16,24.4 | 110.16,24.4 110.16,28.3 U$48.P$6 | U$12.P$6 80.04,28.3 | 77.5,24.4 73.1,20 73.02,20 | 73.02,20 68.89,24.12 68.89,24.4 | U$55.P$6 54,24.4 | U$48.P$6 110.1,26.95 107.55,24.4 | U$48.P$6 110.1,27.26 107.24,24.4 | U$48.P$6 110.1,24.46 110.16,24.4 | U$12.P$6 82.5,25.9 82.5,25 81.9,24.4 | 81.9,24.4 77.5,24.4 | U$12.P$6 80.1,27 77.5,24.4 | U$12.P$6 84,24.4 | U$38.P$4 U$38.P$5 50.1,117.5 | U$38.P$6 U$37.P$4 U$37.P$5 50.1,102.5 | U$37.P$6 U$36.P$4 U$36.P$5 50.1,87.5 | U$36.P$6 U$35.P$4 U$35.P$5 50.1,72.5 | U$35.P$6 U$57.P$4 U$57.P$5 U$57.P$6 U$56.P$4 U$56.P$5 50.1,42.5 | U$56.P$6 U$55.P$4 U$55.P$5 U$55.P$6 | U$47.P$4 U$47.P$5 80.1,117.5 | U$47.P$6 80.1,107.5 | U$16.P$4 U$16.P$5 80.1,102.5 | U$16.P$6 U$13.P$4 U$13.P$5 80.1,87.5 | U$13.P$6 80.1,77.5 U$15.P$5 | U$15.P$4 80.1,72.5 | U$15.P$6 80.1,62.5 | U$14.P$4 U$14.P$5 80.1,57.5 | U$14.P$6 80.1,47.5 U$11.P$5 | U$12.P$6 U$12.P$5 80.1,30.57 80.1,31.66 80.1,42.5 U$11.P$6 U$11.P$5 | U$11.P$4 U$11.P$5 | U$54.P$4 U$54.P$5 110.1,117.5 | U$54.P$6 110.1,107.5 | U$53.P$4 U$53.P$5 110.1,102.5 | U$53.P$6 110.1,92.5 | U$52.P$4 U$52.P$5 110.1,87.5 | U$52.P$6 110.1,77.5 | U$51.P$4 U$51.P$5 110.1,72.5 | U$51.P$6 110.1,62.5 | U$50.P$4 U$50.P$5 110.1,57.5 | U$50.P$6 110.1,47.5 | U$49.P$4 U$49.P$5 110.1,42.5 | U$49.P$6 110.1,32.5 | U$48.P$4 U$48.P$5 U$48.P$6
N$24
  Top 1.016: U$26.P$3 40.5,47.5 R25.2
N$25
  Top 1.016: U$26.P$2 R26.2
N$26
  Top 1.016: U$25.P$3 40.5,62.5 R28.2
N$27
  Top 1.016: U$25.P$2 R29.2
N$28
  Top 1.016: U$25.P$1 40.5,57.5 R30.2
N$30
  Top 1.016: U$26.P$1 40.5,42.5 R27.2
N$31
  Top 1.016: U$24.P$3 40.5,77.5 R31.2
N$32
  Top 1.016: U$24.P$2 R32.2
N$33
  Top 1.016: U$24.P$1 40.5,72.5 R33.2
N$34
  Top 1.016: U$23.P$3 40.5,92.5 R34.2
N$35
  Top 1.016: U$23.P$2 R35.2
N$36
  Top 1.016: U$23.P$1 40.5,87.5 R36.2
N$37
  Top 1.016: U$22.P$3 40.5,107.5 R37.2
N$38
  Top 1.016: U$22.P$2 R38.2
N$39
  Top 1.016: U$22.P$1 40.5,102.5 R39.2
N$40
  Top 1.016: U$21.P$3 40.5,122.5 R40.2
N$41
  Top 1.016: U$21.P$2 R41.2
N$42
  Top 1.016: U$21.P$1 40.5,117.5 R42.2
N$43
  Top 1.016: U$20.P$3 100.5,32.5 R43.2
N$44
  Top 1.016: U$20.P$2 R44.2
N$45
  Top 1.016: U$20.P$1 100.5,27.5 R45.2
N$46
  Top 1.016: U$19.P$3 100.5,47.5 R46.2
N$47
  Top 1.016: U$19.P$2 R47.2
N$48
  Top 1.016: U$19.P$1 100.5,42.5 R48.2
N$49
  Top 1.016: U$18.P$3 100.5,62.5 R49.2
N$50
  Top 1.016: U$18.P$2 R50.2
N$51
  Top 1.016: U$18.P$1 100.5,57.5 R51.2
N$52
  Top 1.016: U$17.P$3 100.5,77.5 R52.2
N$53
  Top 1.016: U$17.P$2 R53.2
N$54
  Top 1.016: U$17.P$1 100.5,72.5 R54.2
N$55
  Top 1.016: U$1.P$2 R56.2
N$56
  Top 1.016: U$1.P$1 70.5,72.5 R57.2
N$57
  Top 1.016: U$1.P$3 70.5,77.5 R55.2
N$58
  Top 1.016: U$2.P$3 70.5,122.5 R58.2
N$59
  Top 1.016: U$2.P$2 R59.2
N$60
  Top 1.016: U$2.P$1 70.5,117.5 R60.2
N$61
  Top 1.016: U$3.P$3 100.5,122.5 R61.2
N$62
  Top 1.016: U$3.P$2 R62.2
N$63
  Top 1.016: U$3.P$1 100.5,117.5 R63.2
N$64
  Top 1.016: U$4.P$3 100.5,92.5 R64.2
N$65
  Top 1.016: U$4.P$2 R65.2
N$66
  Top 1.016: U$4.P$1 100.5,87.5 R66.2
N$67
  Top 1.016: U$5.P$2 R68.2
N$68
  Top 1.016: U$5.P$1 70.5,87.5 R69.2
N$69
  Top 1.016: U$5.P$3 70.5,92.5 R67.2
N$70
  Top 1.016: U$6.P$3 70.5,107.5 R70.2
N$71
  Top 1.016: U$6.P$2 R71.2
N$72
  Top 1.016: U$6.P$1 70.5,102.5 R72.2
N$73
  Top 1.016: U$7.P$3 100.5,107.5 R73.2
N$74
  Top 1.016: U$7.P$2 R74.2
N$75
  Top 1.016: U$7.P$1 100.5,102.5 R75.2
N$76
  Top 1.016: U$8.P$3 70.5,32.5 R76.2
N$77
  Top 1.016: U$8.P$2 R77.2
N$78
  Top 1.016: U$8.P$1 70.5,27.5 R78.2
N$79
  Top 1.016: U$9.P$3 70.5,62.5 R79.2
N$80
  Top 1.016: U$9.P$2 R80.2
N$81
  Top 1.016: U$9.P$1 70.5,57.5 R81.2
N$82
  Top 1.016: U$10.P$3 70.5,47.5 R82.2
N$83
  Top 1.016: U$10.P$2 R83.2
N$84
  Top 1.016: U$10.P$1 70.5,42.5 R84.2
N$85
  Top 1.016: U$49.P$3 115.7,47.5 R85.1
N$86
  Top 1.016: U$49.P$2 R86.1
N$87
  Top 1.016: U$49.P$1 115.7,42.5 R87.1
N$88
  Top 1.016: U$48.P$3 115.7,32.5 R88.1
N$89
  Top 1.016: U$48.P$2 R89.1
N$90
  Top 1.016: U$48.P$1 115.7,27.5 R90.1
N$91
  Top 1.016: U$47.P$3 85.7,122.5 R91.1
N$92
  Top 1.016: U$47.P$2 R92.1
N$93
  Top 1.016: U$47.P$1 85.7,117.5 R93.1
N$94
  Top 1.016: U$16.P$2 R95.1
N$95
  Top 1.016: U$16.P$1 85.7,102.5 R96.1
N$96
  Top 1.016: U$16.P$3 85.7,107.5 R94.1
N$97
  Top 1.016: U$15.P$3 85.7,77.5 R97.1
N$98
  Top 1.016: U$15.P$2 R98.1
N$99
  Top 1.016: U$15.P$1 85.7,72.5 R99.1
N$100
  Top 1.016: U$14.P$3 85.7,62.5 R100.1
N$101
  Top 1.016: U$14.P$2 R101.1
N$102
  Top 1.016: U$14.P$1 85.7,57.5 R102.1
N$103
  Top 1.016: U$13.P$3 85.7,92.5 R103.1
N$104
  Top 1.016: U$13.P$2 R104.1
N$105
  Top 1.016: U$13.P$1 85.7,87.5 R105.1
N$106
  Top 1.016: U$12.P$3 85.7,32.5 R106.1
N$107
  Top 1.016: U$12.P$2 R107.1
N$108
  Top 1.016: U$12.P$1 85.7,27.5 R108.1
N$109
  Top 1.016: U$11.P$3 85.7,47.5 R109.1
N$110
  Top 1.016: U$11.P$2 R110.1
N$111
  Top 1.016: U$11.P$1 85.7,42.5 R111.1
N$112
  Top 1.016: U$57.P$1 55.7,57.5 R112.1
N$113
  Top 1.016: U$57.P$2 R113.1
N$114
  Top 1.016: U$57.P$3 55.7,62.5 R114.1
N$115
  Top 1.016: U$56.P$1 55.7,42.5 R115.1
N$116
  Top 1.016: U$56.P$2 R116.1
N$117
  Top 1.016: U$56.P$3 55.7,47.5 R117.1
N$118
  Top 1.016: U$55.P$1 55.7,27.5 R118.1
N$119
  Top 1.016: U$55.P$2 R119.1
N$120
  Top 1.016: U$55.P$3 55.7,32.5 R120.1
N$121
  Top 1.016: U$54.P$1 115.7,117.5 R121.1
N$122
  Top 1.016: U$54.P$3 115.7,122.5 R122.1
N$123
  Top 1.016: U$54.P$2 R123.1
N$124
  Top 1.016: U$53.P$1 115.7,102.5 R124.1
N$125
  Top 1.016: U$53.P$2 R125.1
N$126
  Top 1.016: U$53.P$3 115.7,107.5 R126.1
N$127
  Top 1.016: U$52.P$1 115.7,87.5 R127.1
N$128
  Top 1.016: U$52.P$2 R128.1
N$129
  Top 1.016: U$52.P$3 115.7,92.5 R129.1
N$130
  Top 1.016: U$51.P$1 115.7,72.5 R130.1
N$131
  Top 1.016: U$51.P$2 R131.1
N$132
  Top 1.016: U$51.P$3 115.7,77.5 R132.1
N$133
  Top 1.016: U$50.P$1 115.7,57.5 R133.1
N$134
  Top 1.016: U$50.P$2 R134.1
N$135
  Top 1.016: U$50.P$3 115.7,62.5 R135.1
N$136
  Top 1.016: U$38.P$1 55.7,117.5 R136.1
N$137
  Top 1.016: U$38.P$2 R137.1
N$138
  Top 1.016: U$38.P$3 55.7,122.5 R138.1
N$139
  Top 1.016: U$37.P$1 55.7,102.5 R139.1
N$140
  Top 1.016: U$37.P$2 R140.1
N$141
  Top 1.016: U$37.P$3 55.7,107.5 R141.1
N$142
  Top 1.016: U$36.P$1 55.7,87.5 R142.1
N$143
  Top 1.016: U$36.P$3 55.7,92.5 R143.1
N$144
  Top 1.016: U$36.P$2 R144.1
N$145
  Top 1.016: U$35.P$1 55.7,72.5 R145.1
N$146
  Top 1.016: U$35.P$2 R146.1
N$147
  Top 1.016: U$35.P$3 55.7,77.5 R147.1
NCC
  pour Bottom (isolate 0.5): -22.5,-17.5 -22.5,162.5 167.5,162.5 167.5,-17.5
VCC
  Top 2: 60,115 60.81,115.81 60.81,118.31 60.85,118.35 R138.2 60.81,122.54 60.81,123.52 60,124.33 60,125 | 60,110 60,109.33 60.81,108.52 60.81,107.54 R141.2 60.85,100.85 60,100 | 60,95 60,94.33 60.81,93.52 60.81,92.54 R143.2 60.85,85.85 60,85 | 60,80 60,79.33 60.81,78.52 60.81,77.54 R147.2 60.85,70.85 60,70 | 60,65 60,64.33 60.81,63.52 60.81,62.54 R114.2 60.85,55.85 60,55 | 60,50 60,49.33 60.81,48.52 60.81,47.54 R117.2 60.85,40.85 60,40 | 60,35 60,34.33 60.81,33.52 60.81,32.54 R120.2 60.85,28.35 60.81,28.31 60.81,27.5 | 90,35 90,34.33 90.81,33.52 90.81,32.54 R106.2 R108.2 R111.2 R109.2 | R109.2 90.85,49.15 90,50 90,49.33 90.81,48.52 90.81,47.54 | R109.2 90.85,51.65 90,52.5 | 90,65 90,64.33 90.81,63.52 90.81,57.54 R102.2 90.85,47.58 90.81,47.54 | R109.2 90.81,47.54 | 90,70 90,70.67 90.81,71.48 90.81,72.46 R99.2 90.81,72.54 90.81,78.52 90,79.33 90,80 | 87.5,85 89.33,85 90.81,86.48 90.81,87.46 R105.2 90.81,87.54 90.81,93.52 90,94.33 90,95 | 90,100 90,100.67 90.81,101.48 90.81,104.96 R95.2 90.81,105.04 90.81,108.52 90,109.33 90,110 | 87.5,115 88.3,115.8 90.13,115.8 90.85,116.52 R92.2 90.81,120.04 90.81,123.52 90,124.33 90,125
  Top 3: J1.1 65,15.09 65,17.5
  Top 4: 65,17.5 65.09,17.41 J1.1 65,14.91 65,12.5 | 69.06,17.26 J1.2 69.06,12.1 68.5,11.54
  pour Top (isolate 0.5): -2.5,0 -2.5,152.5 152.5,152.5 152.5,-2.5 150,-2.5 -2.5,-2.5

### Text on the board
tPlace: WIFI SOLAR LIGHT LED PANNEL
bPlace: WIFI SOLAR LIGHT | LED PANNEL | SFSU PROJECT | VER 1.0 | VCC | VCC | WHITE | GREEN | RED | BLUE | WIFI SOLAR LIGHT | MASTER CONTROLLER | VER 1.0